# EAGLE design midi-in-out-micro (EAGLE 7.7.0)
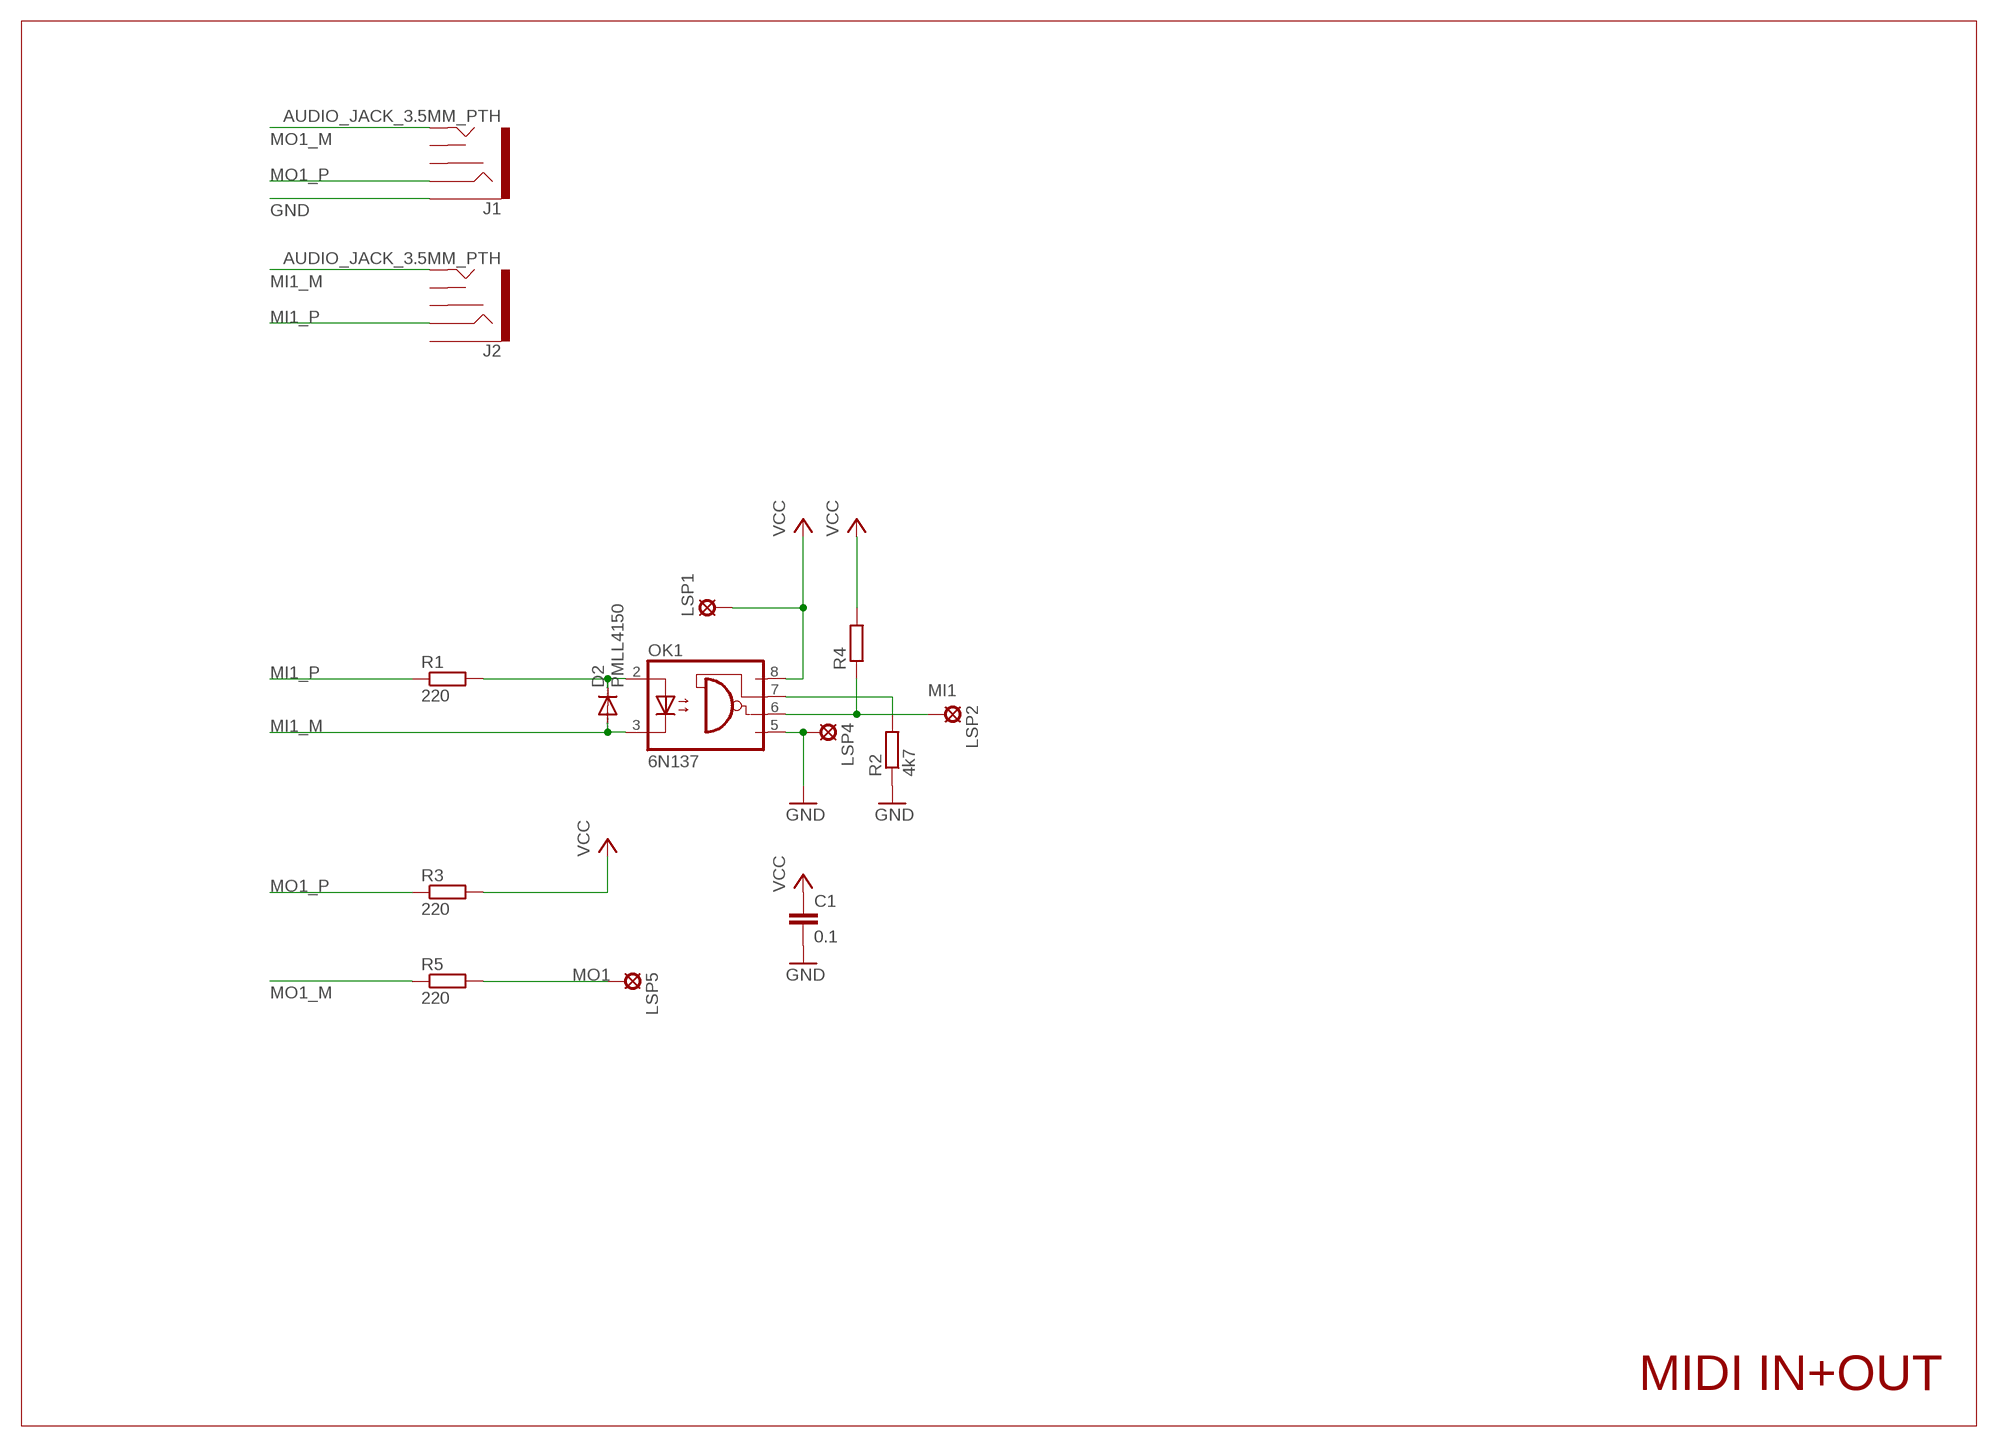
[diagram p0: schematic, sheet 1]

## Parts
C1  0.1  C-EUC0805  [C0805]
D2  PMLL4150  [SOD80C]
J1  AUDIO_JACK_3.5MM_PTH  [AUDIO-JACK]
J2  AUDIO_JACK_3.5MM_PTH  [AUDIO-JACK]
LSP1  MCS10B  [MCS10B]
LSP2  MCS10B  [MCS10B]
LSP4  MCS10B  [MCS10B]
LSP5  MCS10B  [MCS10B]
OK1  6N137  [DIL08]
R1  220  R-EU_R0805  [R0805]
R2  4k7  R-EU_R0805  [R0805]
R3  220  R-EU_R0805  [R0805]
R4  R-EU_0207/5V  [0207/5V]
R5  220  R-EU_R0805  [R0805]

## Nets
GND: C1.2 J1.SLEEVE LSP4.MP OK1.5(GND) R2.1
MI1: LSP2.MP OK1.6(VO) R4.1
MI1_M: D2.A J2.TIP OK1.3(C)
MI1_P: J2.RING R1.1
MO1: LSP5.MP R5.2
MO1_M: J1.TIP R5.1
MO1_P: J1.RING R3.1
N$1: D2.C OK1.2(A) R1.2
N$3: OK1.7(VE) R2.2
VCC: C1.1 LSP1.MP OK1.8(VCC) R3.2 R4.2
Unconnected: J1.RSH J1.TSH J2.RSH J2.SLEEVE J2.TSH

## Notes on the sheet
- MIDI IN+OUT

## Library data of the parts
C1 = rcl:C-EU: CAPACITOR, European symbol
D2 = diode:PMLL4150: DIODE high speed
J1 J2 = SparkFun-Connectors:AUDIO_JACK_3.5MM: Audio Jack 3.5mm variants of PTH and SMT stereo audio jack with bypass switches. SparkFun Products: SparkFun SparkPunk Sound Kit <[https://www.sparkfun.com/products/11177]> - PTH MP3 Trigger <https://www.sparkfun.com/products/13720> -3.5mm SMD SparkFun PicoBoard <https://www.sparkfun.com/products/11888>- 2.5mm SMD; PROD_ID: CONN-08774; SF_ID: PRT-08032
LSP1 LSP2 LSP4 LSP5 = solpad:MCS10B: SOLDER PAD MC S1, distributor Buerklin, 15F505
OK1 = optocoupler:6N137: MOTOROLA OPTO COUPLER; MPN: 6N137; OC_FARNELL: 1328376; OC_NEWARK: 52M1895
R1-R5 = rcl:R-EU_: RESISTOR, European symbol

## Board
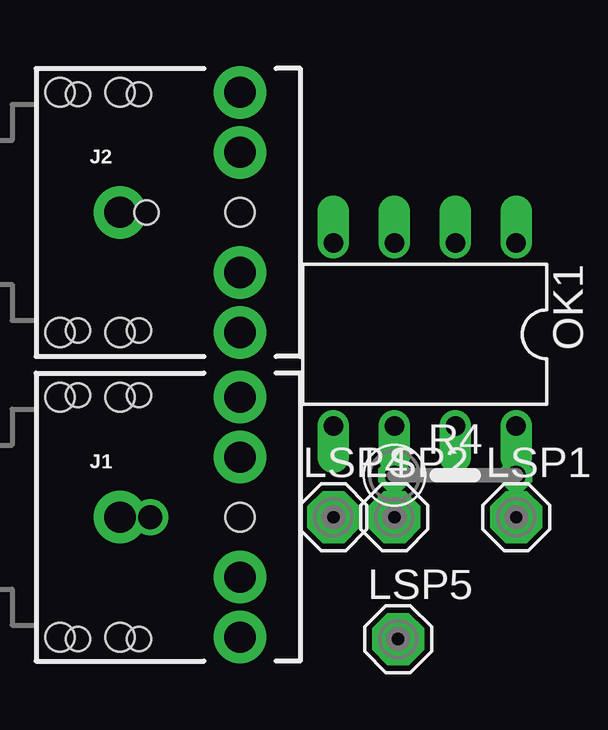
[diagram p1: board, top side]
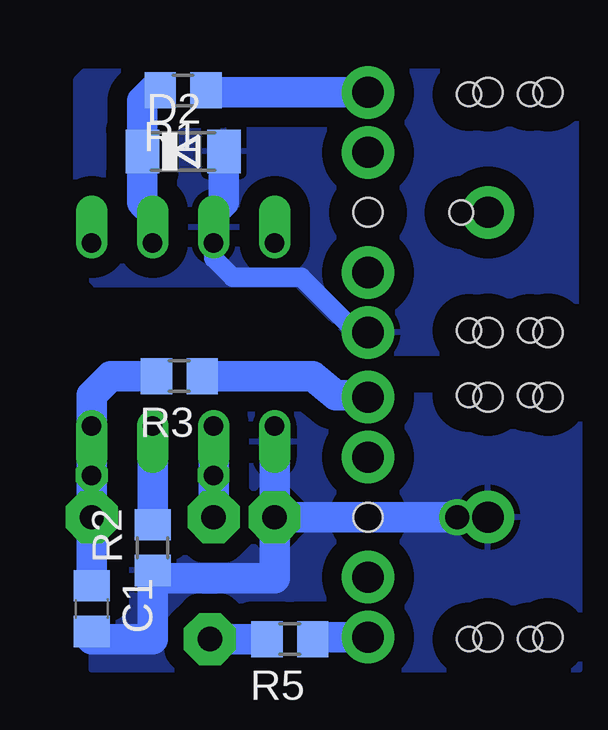
[diagram p2: board, bottom side, seen from below]

No outline drawn. Coordinates in mm, seen from the top.
Copper layers (1*16): Top 0.035mm / dielectric 1.5mm / Bottom 0.035mm
Design rules "default": minimum track width 10mil, minimum drill 24mil, track to track 8mil, track to pad 8mil, pad to pad 8mil, via to via 8mil, smd to smd 8mil, copper to edge 40mil, drill to drill 8mil, minimum pad ring 10mil, minimum via ring 8mil, stop-mask expansion 4mil, vias tented up to drill 0mil, thermal gap 10mil
Holes 1 mm at 2.06,11.43 4.6,11.43 2.06,1.27 4.6,1.27 4.92,19.05 2.06,14.13 4.6,14.13 2.06,23.97 4.6,23.97

### Footprints (pad centres in the part's own frame; a part is rotated, then mirrored left to right if it is on the bottom)
C0805 = smd 1.3 x 1.5: 1 -0.95,0; 2 0.95,0
SOD80C = smd 1.4 x 1.8: A 1.7,0; C -1.7,0
AUDIO-JACK = drill 1.3 pad 2.184: RING 5,5; RSH 5,2.5; SLEEVE 0,0; TIP 5,-5; TSH 5,-2.5 | hole 1.2: 0,5; -2.5,5; -2.5,-5; 0,-5; 5,0
MCS10B = drill 1.016 pad 2.159 octagon: MP 0,0
DIL08 = drill 0.813 offset: 1 -3.81,-3.81; 2 -1.27,-3.81; 3 1.27,-3.81; 4 3.81,-3.81; 5 3.81,3.81; 6 1.27,3.81; 7 -1.27,3.81; 8 -3.81,3.81
R0805 = smd 1.3 x 1.5: 1 -0.95,0; 2 0.95,0
0207/5V = drill 0.813 octagon: 1 -2.54,0; 2 2.54,0

### Placement (x,y rotation side)
C1  20.32,2.54 270 bottom
D2  16.51,21.59 0 bottom
J1  3.81,6.35 0 top
J2  3.81,19.05 0 top
LSP1  20.32,6.35 0 top
LSP2  15.24,6.35 0 top
LSP4  12.7,6.35 0 top
LSP5  15.4,1.27 0 top
OK1  16.51,13.97 180 top
R1  16.51,24.13 180 bottom
R2  17.78,5.08 90 bottom
R3  16.67,12.22 180 bottom
R4  17.78,8.1 0 top
R5  12.06,1.27 180 bottom

### Tracks (layer width: path | path; a pad name or v marks a point on that pad's centre or on a via)
GND  (via drill 1)
  Bottom 1.27: C1.2 20.32,1.27 17.78,1.27 17.78,3.81 | J1.SLEEVE v5.08,6.35 LSP4.MP | OK1.5 LSP4.MP | LSP4.MP 12.7,3.81 17.78,3.81 | 17.78,3.81 R2.1
  pour Bottom (isolate 0.813): 0,0 20.32,0 20.32,11.43 0,11.43
MI1
  Bottom 1.27: OK1.6 R4.1 LSP2.MP
MI1_M
  Bottom 0.813: OK1.3 15.24,17.14 14.45,16.35 11.59,16.35 9.37,14.13 8.89,14.13 J2.TIP
  Bottom 1.27: D2.A 14.81,19.48 15.24,19.05 OK1.3
  pour Bottom (isolate 0.813): 0.48,13.18 8.89,13.18 11.75,16.03 20.16,16.03 20.95,16.83 20.95,24.61 20.64,24.92 0.16,24.92 0.16,13.49
MI1_P
  Bottom 1.27: J2.RING 15.48,24.05 R1.1
MO1
  Bottom 1.27: LSP5.MP R5.2
MO1_M
  Bottom 1.27: J1.TIP 11.04,1.35 R5.1
MO1_P
  Bottom 1.27: R3.1 11.12,12.23 10.16,11.43 8.89,11.43 J1.RING
N$1
  Bottom 1.27: R1.2 17.78,24.13 18.21,23.7 D2.C 18.21,19.48 17.78,19.05 OK1.2
N$3
  Bottom 1.27: R2.2 OK1.7
VCC
  Bottom 1.27: C1.1 LSP1.MP R4.2 OK1.8 20.32,11.43 19.53,12.22 R3.2